# EAGLE design pentawallHDsmall (EAGLE 5.11)
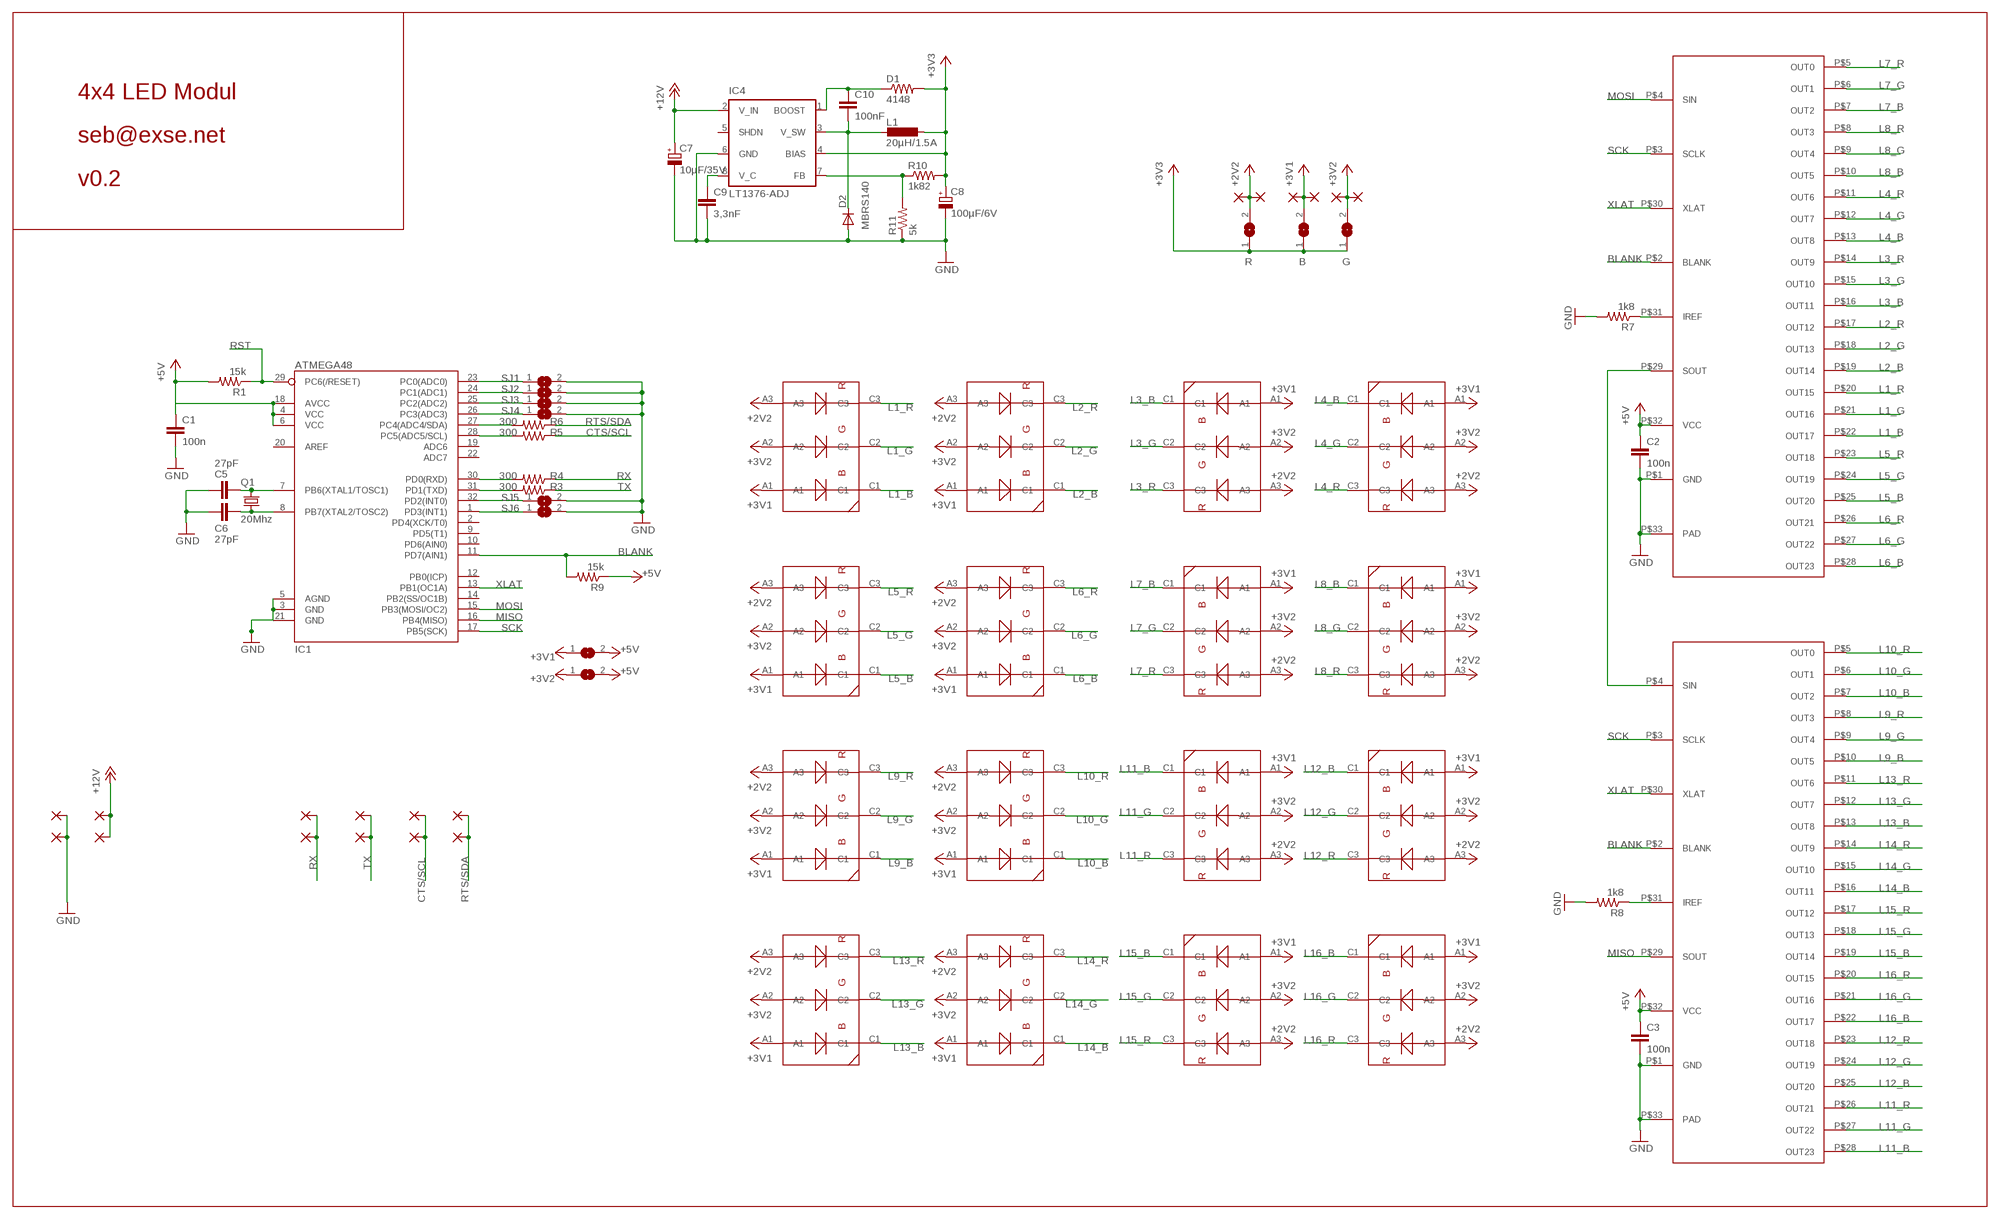
[diagram p0: schematic, sheet 1]

## Parts
B  SMD2  [SMD1,27-2,54]
B2  SMD2  [SMD1,27-2,54]
C1  100n  CAP0805  [0805]
C2  100n  CAP0805  [0805]
C3  100n  CAP0805  [0805]
C5  27pF  CAP0805  [0805]
C6  27pF  CAP0805  [0805]
C7  10µF/35V  CPOL-EUSMCD  [SMC_D]
C8  100µF/6V  CPOL-EUSMCD  [SMC_D]
C9  3,3nF  CAP0805  [0805]
C10  100nF  CAP0805  [0805]
D1  4148  RESISTOR1206  [1206]
D2  MBRS140  DIODE-SMB  [SMB]
G  SMD2  [SMD1,27-2,54]
G2  SMD2  [SMD1,27-2,54]
IC1  ATMEGA48  ATMEGA168  [TQFP32-08]
IC2  TLC5947  [HTSSOP32_DAP]
IC3  TLC5947  [HTSSOP32_DAP]
IC4  LT1376-ADJ  LT1376  [SO-08]
L1  20µH/1.5A  DO3316P  [DO3316P]
PAD1  SMD2  [SMD1,27-2,54]
PAD2  SMD2  [SMD1,27-2,54]
PAD3  SMD2  [SMD1,27-2,54]
PAD4  SMD2  [SMD1,27-2,54]
PAD5  SMD2  [SMD1,27-2,54]
PAD6  SMD2  [SMD1,27-2,54]
PAD7  SMD2  [SMD1,27-2,54]
PAD8  SMD2  [SMD1,27-2,54]
PAD9  SMD2  [SMD1,27-2,54]
PAD10  SMD2  [SMD1,27-2,54]
PAD17  SMD2  [SMD1,27-2,54]
PAD18  SMD2  [SMD1,27-2,54]
Q1  20Mhz  X22-OSCILLATOR  [X22]
R  SMD2  [SMD1,27-2,54]
R1  15k  RESISTOR  [0805]
R2  SMD2  [SMD1,27-2,54]
R3  300  RESISTOR  [0805]
R4  300  RESISTOR  [0805]
R5  300  RESISTOR  [0805]
R6  300  RESISTOR  [0805]
R7  1k8  RESISTOR  [0805]
R8  1k8  RESISTOR  [0805]
R9  15k  RESISTOR  [0805]
R10  1k82  RESISTOR  [0805]
R11  5k  RESISTOR  [0805]
SJ1  SJ  [SJ]
SJ2  SJ  [SJ]
SJ3  SJ  [SJ]
SJ4  SJ  [SJ]
SJ5  SJ  [SJ]
SJ6  SJ  [SJ]
SJ7  SJ  [SJ]
SJ8  SJ  [SJ]
SJ9  SJ  [SJ]
SJ10  SJ  [SJ]
SJ11  SJ  [SJ]
U$1  OSRAM_LRTB_GFTG  OSRAM_LRTB_GFTGSMALL  [PLCC-6_SMALL]
U$2  OSRAM_LRTB_GFTG  OSRAM_LRTB_GFTGSMALL  [PLCC-6_SMALL]
U$3  OSRAM_LRTB_GFTG  OSRAM_LRTB_GFTGSMALL  [PLCC-6_SMALL]
U$4  OSRAM_LRTB_GFTG  OSRAM_LRTB_GFTGSMALL  [PLCC-6_SMALL]
U$5  OSRAM_LRTB_GFTG  OSRAM_LRTB_GFTGSMALL  [PLCC-6_SMALL]
U$6  OSRAM_LRTB_GFTG  OSRAM_LRTB_GFTGSMALL  [PLCC-6_SMALL]
U$7  OSRAM_LRTB_GFTG  OSRAM_LRTB_GFTGSMALL  [PLCC-6_SMALL]
U$8  OSRAM_LRTB_GFTG  OSRAM_LRTB_GFTGSMALL  [PLCC-6_SMALL]
U$9  OSRAM_LRTB_GFTG  OSRAM_LRTB_GFTGSMALL  [PLCC-6_SMALL]
U$10  OSRAM_LRTB_GFTG  OSRAM_LRTB_GFTGSMALL  [PLCC-6_SMALL]
U$11  OSRAM_LRTB_GFTG  OSRAM_LRTB_GFTGSMALL  [PLCC-6_SMALL]
U$12  OSRAM_LRTB_GFTG  OSRAM_LRTB_GFTGSMALL  [PLCC-6_SMALL]
U$13  OSRAM_LRTB_GFTG  OSRAM_LRTB_GFTGSMALL  [PLCC-6_SMALL]
U$14  OSRAM_LRTB_GFTG  OSRAM_LRTB_GFTGSMALL  [PLCC-6_SMALL]
U$15  OSRAM_LRTB_GFTG  OSRAM_LRTB_GFTGSMALL  [PLCC-6_SMALL]
U$16  OSRAM_LRTB_GFTG  OSRAM_LRTB_GFTGSMALL  [PLCC-6_SMALL]

## Nets
+12V: C7.+ IC4.2(V_IN) PAD5.1(P) PAD6.1(P)
BLANK: IC1.11(PD7(AIN1)) IC2.P$2(BLANK) IC3.P$2(BLANK) R9.2
CTS/SCL: PAD7.1(P) PAD8.1(P) R5.1
DVCC: C1.1 C2.1 C3.1 IC1.4(VCC) IC1.6(VCC) IC1.18(AVCC) IC2.P$32(VCC) IC3.P$32(VCC) R1.2 R9.1 SJ7.2 SJ11.2 ; supply symbol labelled +5V
GND: C1.2 C2.2 C3.2 C5.1 C6.1 C7.- C8.- C9.2 D2.A IC1.3(GND) IC1.5(AGND) IC1.21(GND) IC2.P$1(GND) IC2.P$33(PAD) IC3.P$1(GND) IC3.P$33(PAD) IC4.6(GND) PAD1.1(P) PAD2.1(P) R7.2 R8.2 R11.1 SJ1.2 SJ2.2 SJ3.2 SJ4.2 SJ5.2 SJ6.2
L1_B: IC2.P$22(OUT17) U$8.C1
L1_G: IC2.P$21(OUT16) U$8.C2
L1_R: IC2.P$20(OUT15) U$8.C3
L2_B: IC2.P$19(OUT14) U$7.C1
L2_G: IC2.P$18(OUT13) U$7.C2
L2_R: IC2.P$17(OUT12) U$7.C3
L3_B: IC2.P$16(OUT11) U$1.C1
L3_G: IC2.P$15(OUT10) U$1.C2
L3_R: IC2.P$14(OUT9) U$1.C3
L4_B: IC2.P$13(OUT8) U$3.C1
L4_G: IC2.P$12(OUT7) U$3.C2
L4_R: IC2.P$11(OUT6) U$3.C3
L5_B: IC2.P$25(OUT20) U$2.C1
L5_G: IC2.P$24(OUT19) U$2.C2
L5_R: IC2.P$23(OUT18) U$2.C3
L6_B: IC2.P$28(OUT23) U$10.C1
L6_G: IC2.P$27(OUT22) U$10.C2
L6_R: IC2.P$26(OUT21) U$10.C3
L7_B: IC2.P$7(OUT2) U$6.C1
L7_G: IC2.P$6(OUT1) U$6.C2
L7_R: IC2.P$5(OUT0) U$6.C3
L8_B: IC2.P$10(OUT5) U$9.C1
L8_G: IC2.P$9(OUT4) U$9.C2
L8_R: IC2.P$8(OUT3) U$9.C3
L9_B: IC3.P$10(OUT5) U$14.C1
L9_G: IC3.P$9(OUT4) U$14.C2
L9_R: IC3.P$8(OUT3) U$14.C3
L10_B: IC3.P$7(OUT2) U$13.C1
L10_G: IC3.P$6(OUT1) U$13.C2
L10_R: IC3.P$5(OUT0) U$13.C3
L11_B: IC3.P$28(OUT23) U$12.C1
L11_G: IC3.P$27(OUT22) U$12.C2
L11_R: IC3.P$26(OUT21) U$12.C3
L12_B: IC3.P$25(OUT20) U$5.C1
L12_G: IC3.P$24(OUT19) U$5.C2
L12_R: IC3.P$23(OUT18) U$5.C3
L13_B: IC3.P$13(OUT8) U$11.C1
L13_G: IC3.P$12(OUT7) U$11.C2
L13_R: IC3.P$11(OUT6) U$11.C3
L14_B: IC3.P$16(OUT11) U$15.C1
L14_G: IC3.P$15(OUT10) U$15.C2
L14_R: IC3.P$14(OUT9) U$15.C3
L15_B: IC3.P$19(OUT14) U$16.C1
L15_G: IC3.P$18(OUT13) U$16.C2
L15_R: IC3.P$17(OUT12) U$16.C3
L16_B: IC3.P$22(OUT17) U$4.C1
L16_G: IC3.P$21(OUT16) U$4.C2
L16_R: IC3.P$20(OUT15) U$4.C3
MISO: IC1.16(PB4(MISO)) IC3.P$29(SOUT)
MOSI: IC1.15(PB3(MOSI/OC2)) IC2.P$4(SIN)
N$1: IC1.23(PC0(ADC0)) SJ1.1
N$2: IC1.30(PD0(RXD)) R4.2
N$3: IC1.28(PC5(ADC5/SCL)) R5.2
N$4: IC1.24(PC1(ADC1)) SJ2.1
N$5: IC1.25(PC2(ADC2)) SJ3.1
N$6: IC1.26(PC3(ADC3)) SJ4.1
N$7: IC1.1(PD3(INT1)) SJ6.1
N$8: IC1.32(PD2(INT0)) SJ5.1
N$9: IC2.P$29(SOUT) IC3.P$4(SIN)
N$10: IC4.7(FB) R10.1 R11.2
N$11: IC3.P$31(IREF) R8.1
N$12: IC2.P$31(IREF) R7.1
N$13: IC1.31(PD1(TXD)) R3.2
N$15: IC1.27(PC4(ADC4/SDA)) R6.2
N$30: C5.2 IC1.7(PB6(XTAL1/TOSC1)) Q1.3
N$32: C6.2 IC1.8(PB7(XTAL2/TOSC2)) Q1.1
N$56: C9.1 IC4.8(V_C)
N$57: C10.2 D2.C IC4.3(V_SW) L1.1
N$58: C10.1 D1.1 IC4.1(BOOST)
RST: IC1.29(PC6(/RESET)) R1.1
RTS/SDA: PAD9.1(P) PAD10.1(P) R6.1
RX: PAD17.1(P) PAD18.1(P) R4.1
SCK: IC1.17(PB5(SCK)) IC2.P$3(SCLK) IC3.P$3(SCLK)
TX: PAD3.1(P) PAD4.1(P) R3.1
VCC: C8.+ D1.2 IC4.4(BIAS) L1.2 R10.2 SJ8.1 SJ9.1 SJ10.1 ; supply symbol labelled +3V3
VCC_B: B2.1(P) B.1(P) SJ7.1 SJ9.2 U$1.A1 U$2.A1 U$3.A1 U$4.A1 U$5.A1 U$6.A1 U$7.A1 U$8.A1 U$9.A1 U$10.A1 U$11.A1 U$12.A1 U$13.A1 U$14.A1 U$15.A1 U$16.A1 ; supply symbol labelled +3V1
VCC_G: G2.1(P) G.1(P) SJ10.2 SJ11.1 U$1.A2 U$2.A2 U$3.A2 U$4.A2 U$5.A2 U$6.A2 U$7.A2 U$8.A2 U$9.A2 U$10.A2 U$11.A2 U$12.A2 U$13.A2 U$14.A2 U$15.A2 U$16.A2 ; supply symbol labelled +3V2
VCC_R: R2.1(P) R.1(P) SJ8.2 U$1.A3 U$2.A3 U$3.A3 U$4.A3 U$5.A3 U$6.A3 U$7.A3 U$8.A3 U$9.A3 U$10.A3 U$11.A3 U$12.A3 U$13.A3 U$14.A3 U$15.A3 U$16.A3 ; supply symbol labelled +2V2
XLAT: IC1.13(PB1(OC1A)) IC2.P$30(XLAT) IC3.P$30(XLAT)
Unconnected: IC1.2(PD4(XCK/T0)) IC1.9(PD5(T1)) IC1.10(PD6(AIN0)) IC1.12(PB0(ICP)) IC1.14(PB2(SS/OC1B)) IC1.19(ADC6) IC1.20(AREF) IC1.22(ADC7) IC4.5(SHDN)

## Notes on the sheet
- 4x4 LED Modul
- seb@exse.net
- v0.2

## Library data of the parts
B B2 G G2 PAD1-PAD10 PAD17 PAD18 R R2 = wirepad:SMD2: SMD PAD
C1-C3 C5 C6 C9 C10 = SparkFun:CAP: Capacitor Standard 0603 ceramic capacitor, and 0.1" leaded capacitor.
C7 C8 = resistor:CPOL-EU: POLARIZED CAPACITOR, European symbol
D1 R1 R3-R11 = SparkFun:RESISTOR: Resistor Basic schematic elements and footprints for 0603, 1206, and PTH 1/10th watt (small) resistors.
D2 = diode:DIODE-: DIODE
IC1 = SparkFun:ATMEGA168
IC2 IC3 = tlc5947:TLC5947
IC4 = v-reg:LT1376
L1 = inductor-coilcraft:DO3316P: COILCRAFT; OC_FARNELL: unknown; OC_NEWARK: unknown
Q1 = seb:X22-OSCILLATOR
SJ1-SJ11 = jumper:SJ: SMD solder JUMPER
U$1-U$16 = seb:OSRAM_LRTB_GFTG

## Board
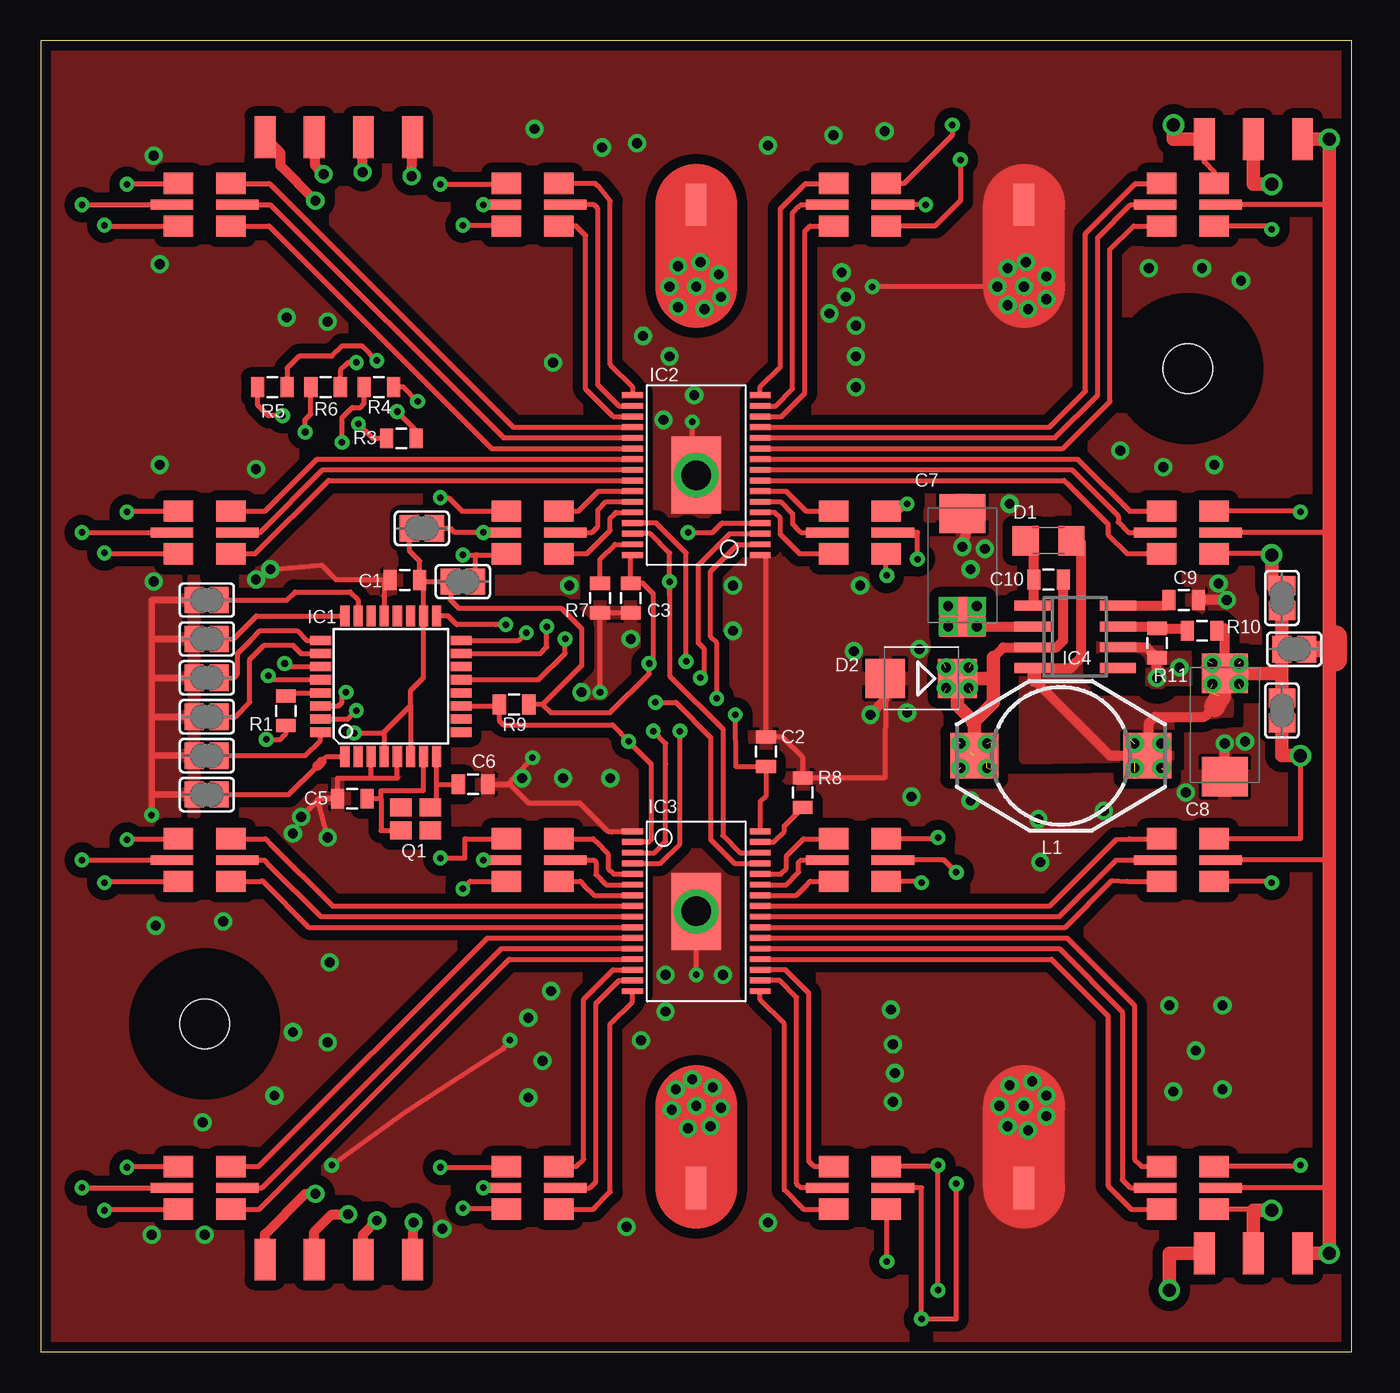
[diagram p1: board, top side]
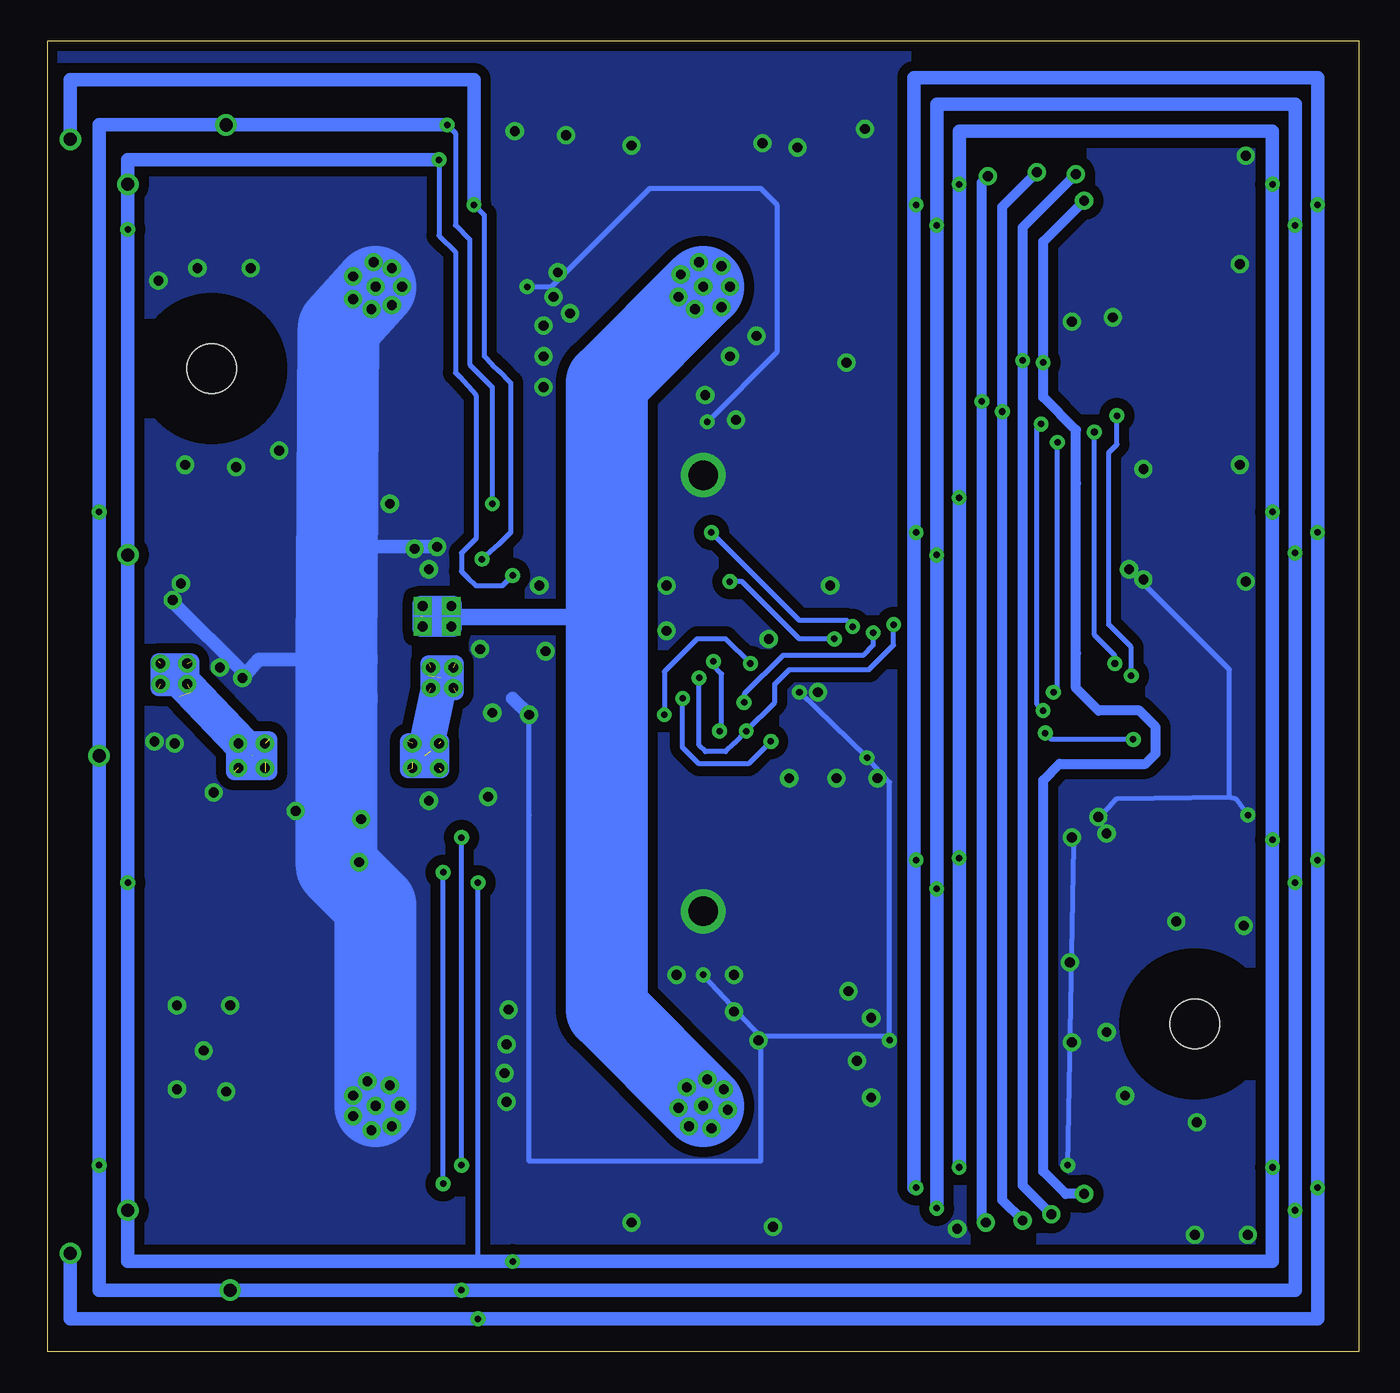
[diagram p2: board, bottom side, seen from below]

Size 80 x 80 mm. Coordinates in mm from the lower left corner, seen from the top.
Outline: 80,0 80,80 0,80 0,0 80,0
Copper layers (1*16): Top 0.035mm / dielectric 1.5mm / Bottom 0.035mm
Design rules "PCBCart-Standard *": minimum track width 12mil, minimum drill 0.4mm, track to track 13mil, track to pad 12mil, pad to pad 9mil, via to via 13mil, smd to smd 8mil, copper to edge 20mil, drill to drill 8mil, minimum pad ring 8mil, minimum via ring 10mil, stop-mask expansion 2mil, vias tented up to drill 2mm, thermal gap 8mil
Holes 3 mm at 10,20 70,60
tKeepout: 1 lines
tRestrict: area 69,59 to 71,61; area 9,19 to 11,21
bRestrict: area 69,59 to 71,61; area 9,19 to 11,21

### Footprints (pad centres in the part's own frame; a part is rotated, then mirrored left to right if it is on the bottom)
SMD1,27-2,54 = smd 1.27 x 2.54: 1 0,0
0805 = smd 0.8 x 1.2: 1 -0.9,0; 2 0.9,0
SMC_D = smd 2.4 x 2.8: + -3.15,0; - 3.15,0
1206 = smd 1.6 x 1.8: 1 -1.4,0; 2 1.4,0
SMB = smd 2.4 x 2.4: A 2.2,0; C -2.2,0
TQFP32-08 = smd 1.27 x 0.559: 1 -4.293,2.8; 2 -4.293,2; 3 -4.293,1.2; 4 -4.293,0.4; 5 -4.293,-0.4; 6 -4.293,-1.2; 7 -4.293,-2; 8 -4.293,-2.8; 17 4.293,-2.8; 18 4.293,-2; 19 4.293,-1.2; 20 4.293,-0.4; 21 4.293,0.4; 22 4.293,1.2; 23 4.293,2; 24 4.293,2.8 | smd 0.559 x 1.27: 9 -2.8,-4.293; 10 -2,-4.293; 11 -1.2,-4.293; 12 -0.4,-4.293; 13 0.4,-4.293; 14 1.2,-4.293; 15 2,-4.293; 16 2.8,-4.293; 25 2.8,4.293; 26 2,4.293; 27 1.2,4.293; 28 0.4,4.293; 29 -0.4,4.293; 30 -1.2,4.293; 31 -2,4.293; 32 -2.8,4.293
HTSSOP32_DAP = smd 0.356 x 1.27: P$1 -4.875,-3.9; P$2 -4.225,-3.9; P$3 -3.575,-3.9; P$4 -2.925,-3.9; P$5 -2.275,-3.9; P$6 -1.625,-3.9; P$7 -0.975,-3.9; P$8 -0.325,-3.9; P$9 0.325,-3.9; P$10 0.975,-3.9; P$11 1.625,-3.9; P$12 2.275,-3.9; P$13 2.925,-3.9; P$14 3.575,-3.9; P$15 4.225,-3.9; P$16 4.875,-3.9; P$17 4.875,3.9; P$18 4.225,3.9; P$19 3.575,3.9; P$20 2.925,3.9; P$21 2.275,3.9; P$22 1.625,3.9; P$23 0.975,3.9; P$24 0.325,3.9; P$25 -0.325,3.9; P$26 -0.975,3.9; P$27 -1.625,3.9; P$28 -2.275,3.9; P$29 -2.925,3.9; P$30 -3.575,3.9; P$31 -4.225,3.9; P$32 -4.875,3.9 | smd 4.698 x 3: P$33 0,0
SO-08 = smd 0.6 x 2.2: 1 -1.905,-2.6; 2 -0.635,-2.6; 3 0.635,-2.6; 4 1.905,-2.6; 5 1.905,2.6; 6 0.635,2.6; 7 -0.635,2.6; 8 -1.905,2.6
DO3316P = smd 2.92 x 2.79: 1 -5.28,0; 2 5.28,0
X22 = smd 1.3 x 1.1: 1 0.9,0.7; 2 -0.9,0.7; 3 -0.9,-0.7; 4 0.9,-0.7
SJ = smd 1.168 x 1.6: 1 -0.762,0; 2 0.762,0
PLCC-6_SMALL = smd 1.3 x 1.8: A1 1.3,-1.6; A3 -1.3,-1.6; C1 1.3,1.6; C3 -1.3,1.6 | smd 0.6 x 2.6: A2 0,-2; C2 0,2

### Placement (x,y rotation side)
B  71,6 180 top
B2  71,74 180 top
C1  22.21,47.09 180 top
C2  44.25,36.62 90 top
C3  36,46 270 top
C5  19,33.75 0 top
C6  26.38,34.62 180 top
C7  56.25,48 90 top
C8  72.25,38.25 270 top
C9  69.75,45.88 0 top
C10  61.5,47.12 0 top
D1  61.5,49.5 0 top
D2  53.73,41.09 180 top
G  77,6 180 top
G2  77,74 180 top
IC1  21.36,40.61 90 top
IC2  40,53.5 90 top
IC3  40,26.88 270 top
IC4  63.12,43.62 270 top
L1  62.25,36.38 0 top
PAD1  60,70 0 top
PAD2  60,10 0 top
PAD3  19.68,74.12 180 top
PAD4  19.68,5.62 180 top
PAD5  40,10 0 top
PAD6  40,70 180 top
PAD7  16.68,74.12 0 top
PAD8  16.68,5.62 0 top
PAD9  13.68,74.12 0 top
PAD10  13.68,5.62 0 top
PAD17  22.68,5.62 180 top
PAD18  22.68,74.12 180 top
Q1  22.88,32.5 0 top
R  74,6 180 top
R1  14.96,39.11 270 top
R2  74,74 180 top
R3  22,55.75 180 top
R4  20.62,58.88 180 top
R5  14.12,58.88 180 top
R6  17.38,58.88 180 top
R7  34.12,46 270 top
R8  46.5,34.12 90 top
R9  28.88,39.5 180 top
R10  70.88,44 0 top
R11  68.12,43.25 90 top
SJ1  10.12,45.88 180 top
SJ2  10.12,43.5 180 top
SJ3  10.12,41.12 180 top
SJ4  10.12,38.75 180 top
SJ5  10.12,36.38 180 top
SJ6  10.12,34 180 top
SJ7  25.75,47 180 top
SJ8  75.75,46 90 top
SJ9  75.75,39.12 270 top
SJ10  76.5,42.88 0 top
SJ11  23.25,50.25 180 top
U$1  50,70 90 top
U$2  10,50 270 top
U$3  70,70 90 top
U$4  70,10 90 top
U$5  70,30 90 top
U$6  50,50 90 top
U$7  30,70 270 top
U$8  10,70 270 top
U$9  70,50 90 top
U$10  30,50 270 top
U$11  10,10 270 top
U$12  50,30 90 top
U$13  30,30 270 top
U$14  10,30 270 top
U$15  30,10 270 top
U$16  50,10 90 top

### Tracks (layer width: path | path; a pad name or v marks a point on that pad's centre or on a via)
+12V  (via drill 0.6)  (2 unrouted)
  Top 0.305: v40,15 39.5,14.5 v39.5,13.62 39.62,13.75 v40.88,13.75 41.5,14.38 v41.5,14.88 41,15.38 v41,16.12 40.5,16.62 v39.75,16.62 39.12,16 v38.75,16 38.5,15.75 v38.5,14.75 | v40,65 40.25,65.25 v40.25,66.5 40.12,66.25 v38.88,66.25 38.5,65.88 v38.38,65 39.12,64.38 v38.88,63.75 39.5,63.5 v40.5,63.62 41.12,64.38 v41.5,64.38 v41.38,65.75
  Top 0.61: IC4.2 56.97,44.26 C7.+
  Top 1.016: v55.38,45.5 55.38,44.85 C7.+ | v55.38,44.25 v55.38,45.5 | v55.38,45.5 v57.12,45.5 | C7.+ 57.12,44.85 v57.12,44.25 56.25,44.25 C7.+
  Top 5: v40,65 PAD6.1 | PAD5.1 v40,15
  Bottom 1.016: 45.88,42.5 46.5,43.12 46.5,43.5 46.62,43.62 46.62,44.85 C7.+ | 57.25,44.88 57.25,44.12 55.25,44.12 55.25,44.88 | 57.25,44.88 57.25,45.62 55.25,45.62 55.25,44.88 | 55.25,44.88 57.25,44.88 | 55.25,44.88 57.25,44.88
  Bottom 5: v40,65 45.88,59.12 45.88,42.5 45.88,20.88 v40,15
BLANK  (via drill 0.4)
  Top 0.305: IC2.P$2 42.52,49.27 41.25,48 40.88,47.62 40.88,43.62 41.25,43.25 v41.25,39.88 | IC1.11 27.98,39.41 R9.2 27.98,38.52 28.25,38.25 34.88,38.25 v35.88,37.25 37.25,35.88 37.25,34.75 37.25,31.25 37.1,31.1 IC3.P$2
  Bottom 0.305: v41.25,39.88 41.25,36.88 40.25,35.88 37.25,35.88 v35.88,37.25
CTS/SCL  (via drill 0.4, 0.6)
  Top 0.305: R5.1 15.03,60.02 15.75,60.75 17.75,60.75 18.38,61.38 19.38,61.38 19.62,61.38 v20.5,60.5
  Top 0.61: v17.25,71.88 16.75,72.38 PAD7.1 | v18.75,8.38 17.75,8.38 16.68,7.3 PAD8.1
  Bottom 0.305: 20.5,60.38 v20.5,60.5
  Bottom 0.61: v18.75,8.38 20.5,10.12 20.5,37.5 20.5,60.38 v20.5,60.5 20.5,68.62 v17.25,71.88
DVCC  (via drill 0.4)
  Top 0.305: IC2.P$32 36,48.6 C3.1 36.73,46.9 37.38,46.25 37.38,42.25 v37.12,42 37.12,41.38 34.75,39 31.12,39 30.62,39.5 | v42.38,38.88 42.4,35.73 C2.1 44.25,33.9 43.9,33.55 IC3.P$32 | 20.95,37.83 IC1.4 | 20.95,37.83 22.56,39.44 | IC1.6 22.55,39.3 22.56,39.44 | 23.36,46.62 23.36,46.76 | 23.36,46.62 IC1.18 23.36,41.15 22.56,40.35 22.56,39.44 | 23.11,47.12 23.11,47.4 23.12,48.25 22.5,48.88 22.5,49.25 22.5,50.25 SJ11.2 | 23.36,46.62 23.11,47.12 | 30.62,39.5 R9.1 | 30.62,39.5 33,41.88 33,44.12 31.75,45.38 25.5,45.38 24.99,45.89 SJ7.2 23.11,47 C1.1 23.11,47.12 | v19.12,37.75 20.88,37.75 20.95,37.83 | v13.75,37.38 14.62,37.38 14.88,37.62 14.96,37.71 R1.2
  Bottom 0.305: v42.38,38.88 42.38,41.5 40.38,43.5 39.12,43.5 38.62,43.5 v37.12,42 | v13.75,37.38 18.75,37.38 v19.12,37.75
GND  (via drill 0.4, 0.6, 1.8)
  Top 0.305: IC2.P$1 44.25,48.6 C2.2 45.23,37.52 46.5,36.25 R8.2 51.5,35.02 D2.A | IC3.P$1 34.62,31.75 32.88,33.5 29.75,33.5 28.62,34.62 C6.1 28.5,34.65 v30,36.25 | C5.1 17,33.75 v15.88,32.62 | IC1.5 21.75,35 20.16,35 | 20.16,35 IC1.3 | 20.16,35 18.1,35 C5.1 | 20.95,47.09 C1.2 21.38,47.09 | 20.95,47.09 IC1.21 | 20.95,47.09 20.95,47.12 18,47.12 17.12,48 v14,47.75 | v28.62,19 28.25,18.5 22.25,14.62 v17.75,11.38 | v40,23 IC3.P$33 | IC2.P$33 39.75,53.75 v39.75,56.75 | v60,65 v50.75,65 | C3.2 R7.2 34.12,40.62 v34.12,40.25 | C5.1 16.88,33.73 v17.5,31.38
  Top 0.406: SJ1.2 6.75,45.88 6.75,43.5 | v6.75,32.75 6.75,34 | 6.75,34 6.75,36.38 | 6.75,38.75 6.75,41.12 | 6.75,43.5 SJ2.2 | 6.75,41.12 SJ3.2 | 6.75,41.12 6.75,43.5 | 6.75,38.75 SJ4.2 | 6.75,36.38 SJ5.2 | 6.75,36.38 6.75,38.75 | 6.75,34 SJ6.2
  Top 0.61: IC4.6 67.48,42.99 R11.1 v68.12,41.12 | v72.38,45.88 C9.2 | C8.- v72.25,37.12 | C7.- 56.88,51.27 v56.25,49.12 | D2.A 51.5,39.82 v50.62,38.88
  Top 5: v60,65 PAD1.1 | PAD2.1 v60,15
  Bottom 0.305: v6.75,32.75 7.5,33.75 7.88,33.87 | 7.88,33.87 14.75,33.75 15.12,33.38 v15.88,32.62 | v28.62,19 28.62,19.25 | 28.62,19.25 28.62,34.75 v30,36.25 v34.12,40.25 | 28.62,19.25 36.5,19.25 | v39.75,56.75 35.5,61 35.5,70 36.5,71 43.25,71 49.25,65 v50.75,65 | 36.5,19.25 36.5,11.62 50.62,11.62 50.62,32.75 v50.62,38.88 | 36.5,19.25 v40,23 | v14,47.75 7.88,41.63 7.88,33.87 | v17.5,31.38 17.38,30.88 v17.75,11.38
  Bottom 0.61: 72.25,45.62 v72.38,45.88
  Bottom 0.813: v68.12,41.12 68.25,41.25 | 72.25,45.62 68.12,41.5 v68.12,41.12 | v68.12,41.12 67.12,42.25 62.38,42.25 | v56.25,49.12 60.49,49.13 62.25,62.51 | v50.62,38.88 51.62,39.87
  Bottom 5: v60,15 60,27.25 62.38,29.62 62.38,39.87 62.38,42.25 62.25,62.51 v60,65
  other vias: 69.5,41.75 73.5,37.25 57.62,49 49.62,42.75 69.88,34.12 71.88,46.88 59.12,51.75 56.75,47.75 53.62,42.88 52.88,39 70.5,18.38 73.25,65.38 51.5,74.5 44.38,73.62 60.12,66.5 59,63.88 60.25,63.62 58.38,65 61.38,65.62 61.38,64.25 59,66.12 61.38,15.62 61.38,14.38 58.5,15 59,13.75 59.12,16.25 60.5,16.5 52,15.25 52.12,17 52,18.75 51.88,20.88 41.62,23 38.12,23 36.62,19 38.12,20.75 49.75,58.88 49.75,60.75 49.75,62.62 48.88,65.88 48.12,63.38 49.12,64.38 38,56.88 39.88,58.38 38.38,60.75 36.75,62 7,26 6.88,47 13.12,47.12 15.38,31.62 34.75,35 31.88,35 29.38,35 31.25,60.38 13.12,53.88 15,63.12 7.25,66.38 7.25,54.12 9.88,14 14.25,15.62 15.38,19.5 11.12,26.25 69.12,15.88 72.12,16 72.12,21.12 68.88,21.12 71.62,54.12 68.5,54 65.88,55 67.62,66.12 70.88,66.12 30.12,74.62 34.25,73.5 36.38,73.75 48.38,74.25 64.88,33 61,29.88 60.88,32.5 56.75,33.62 53.12,33.88 40,26.88 40,53.5 60.25,13.5 33,40.25 36,43.5 42.25,44 42.25,46.75 31.12,22 29.75,20.38 30.62,17.75 29.75,15.5 24.5,7.5 35.75,7.62 44.38,7.88 17.62,23.75 17.5,18.88 10,7.12 6.75,7.12 6.88,73 17.5,62.88 32.25,46.75 50,46.75
  pour Bottom (isolate 0.61): 0,0 80,0 80,80 0,80
  pour Top (isolate 0.61, rank 2): 80,0 0,0 0,80 80,80
L1_B
  Top 0.305: IC2.P$22 27.5,55.12 13.93,68.7 U$8.C1
L1_G
  Top 0.305: IC2.P$21 28.23,55.77 14,70 U$8.C2
L1_R
  Top 0.305: IC2.P$20 28.82,56.42 13.95,71.3 U$8.C3
L2_B
  Top 0.305: IC2.P$19 34.92,57.08 33.25,58.75 33.25,68.12 33.12,68.25 32.67,68.7 U$7.C1
L2_G
  Top 0.305: IC2.P$18 35.27,57.73 34,59 34,69.75 33.75,70 U$7.C2
L2_R
  Top 0.305: U$7.C3 33.83,71.3 34.12,71 34.75,70.25 34.75,60.25 36.1,58.9 IC2.P$17
L3_B
  Top 0.305: U$1.C1 46.67,71.3 46.5,71.12 45.12,69.75 45.12,60.12 43.9,58.9 IC2.P$16
L3_G
  Top 0.305: IC2.P$15 44.85,57.73 45.88,58.75 45.88,69.5 46.25,69.88 46.38,70 U$1.C2
L3_R
  Top 0.305: IC2.P$14 45.2,57.08 46.62,58.5 46.62,68.38 46.75,68.5 46.95,68.7 U$1.C3
L4_B
  Top 0.305: IC2.P$13 61.55,56.42 63.75,58.62 63.75,68.25 66.8,71.3 U$3.C1
L4_G
  Top 0.305: IC2.P$12 61.9,55.77 64.5,58.38 64.5,68 66.5,70 U$3.C2
L4_R
  Top 0.305: IC2.P$11 62.38,55.12 65.25,58 65.25,67.3 66.62,68.62 66.7,68.7 U$3.C3
L5_B
  Top 0.305: IC2.P$25 17.55,53.17 13.07,48.7 U$2.C1
L5_G
  Top 0.305: IC2.P$24 17.2,53.83 13.38,50 U$2.C2
L5_R
  Top 0.305: IC2.P$23 16.85,54.48 13.68,51.3 U$2.C3
L6_B
  Top 0.305: U$10.C1 33.33,48.7 34.5,49.88 34.75,50.12 34.75,50.88 35,51.12 35.1,51.23 IC2.P$28
L6_G
  Top 0.305: U$10.C2 33.62,50 34,50.38 34,51.38 34.5,51.88 IC2.P$27
L6_R
  Top 0.305: IC2.P$26 34.02,52.52 33,51.5 32.8,51.3 U$10.C3
L7_B
  Top 0.305: IC2.P$7 45.48,52.52 46.5,51.5 46.7,51.3 U$6.C1
L7_G
  Top 0.305: IC2.P$6 45.12,51.88 45.88,51.12 45.88,50.5 46.25,50.12 46.38,50 U$6.C2
L7_R
  Top 0.305: IC2.P$5 44.77,51.23 45.12,50.88 45.12,49.88 46.3,48.7 U$6.C3
L8_B
  Top 0.305: IC2.P$10 63.27,54.48 63.62,54.12 66.45,51.3 U$9.C1
L8_G
  Top 0.305: U$9.C2 66.38,50 65.75,50.62 65.75,51 63.12,53.62 62.92,53.83 IC2.P$9
L8_R
  Top 0.305: IC2.P$8 62.45,53.17 62.62,53 65.12,50.5 65.12,49.88 66.3,48.7 U$9.C3
L9_B
  Top 0.305: IC3.P$10 16.35,25.9 13.5,28.75 13.45,28.7 U$14.C1
L9_G
  Top 0.305: IC3.P$9 17.07,26.55 13.88,29.75 13.62,30 U$14.C2
L9_R
  Top 0.305: IC3.P$8 17.8,27.2 14,31 13.7,31.3 U$14.C3
L10_B
  Top 0.305: IC3.P$7 33.77,27.85 33.12,28.5 32.92,28.7 U$13.C1
L10_G
  Top 0.305: IC3.P$6 34.5,28.5 33.88,29.12 33.88,29.88 33.75,30 U$13.C2
L10_R
  Top 0.305: IC3.P$5 34.98,29.15 34.62,29.5 34.62,30.38 33.88,31.12 33.7,31.3 U$13.C3
L11_B
  Top 0.305: IC3.P$28 45.15,29.15 45.5,29.5 45.5,30.25 46.5,31.25 46.55,31.3 U$12.C1
L11_G
  Top 0.305: IC3.P$27 45.5,28.5 46.25,29.25 46.25,29.88 46.38,30 U$12.C2
L11_R
  Top 0.305: IC3.P$26 46.1,27.85 46.75,28.5 46.95,28.7 U$12.C3
L12_B
  Top 0.305: IC3.P$25 61.58,27.2 65.62,31.25 66.42,31.3 U$5.C1
L12_G
  Top 0.305: IC3.P$24 62.17,26.55 65.38,29.75 65.62,30 U$5.C2
L12_R
  Top 0.305: IC3.P$23 62.52,25.9 65.38,28.75 66.3,28.7 U$5.C3
L13_B
  Top 0.305: IC3.P$13 28.57,23.95 13.32,8.7 U$11.C1
L13_G
  Top 0.305: IC3.P$12 28.1,24.6 13.5,10 U$11.C2
L13_R
  Top 0.305: 36.12,25.25 IC3.P$11 27.25,25.25 13.3,11.3 U$11.C3
L14_B
  Top 0.305: 33.7,8.7 33.88,8.88 | U$15.C1 33.7,8.7 | IC3.P$16 36.1,21.35 34.75,20 34.75,9.75 33.7,8.7
L14_G
  Top 0.305: IC3.P$15 35.27,22.65 33.88,21.25 33.88,10.38 33.5,10 U$15.C2
L14_R
  Top 0.305: IC3.P$14 34.92,23.3 33.12,21.5 33.12,11.75 32.67,11.3 U$15.C3
L15_B
  Top 0.305: IC3.P$19 45.45,23.3 46.88,21.88 46.88,11.62 47.12,11.38 47.2,11.3 U$16.C1
L15_G
  Top 0.305: IC3.P$18 45.1,22.65 46.12,21.62 46.12,10.25 46.25,10.12 46.38,10 U$16.C2
L15_R
  Top 0.305: 46.55,8.7 46.38,8.88 | 46.55,8.7 U$16.C3 | IC3.P$17 43.9,21.48 45.38,20 45.38,9.88 46.55,8.7
L16_B
  Top 0.305: IC3.P$22 62.62,25.25 66.75,21.12 66.75,11.75 67.12,11.38 67.2,11.3 U$4.C1
L16_G
  Top 0.305: IC3.P$21 62.15,24.6 66,20.75 66,10.5 66.38,10.12 66.5,10 U$4.C2
L16_R
  Top 0.305: IC3.P$20 61.67,23.95 65.12,20.5 65.12,10.12 66.38,8.88 66.55,8.7 U$4.C3
MISO  (via drill 0.4)
  Top 0.305: v37.5,39.62 38.75,39.62 40.88,37.5 40.88,31.25 42.33,29.8 IC3.P$29 | IC1.16 29.16,43.41 v29.62,43.88
  Bottom 0.305: v29.62,43.88 29.62,43.12 30.25,42.5 35.12,42.5 37.5,40.12 v37.5,39.62
MOSI  (via drill 0.4)
  Top 0.305: IC1.15 30.48,42.61 30.88,43 v30.88,44.25 | IC2.P$4 41.58,50.58 41,50 v39.5,50
  Bottom 0.305: v39.5,50 36.25,46.75 34.12,44.62 31.25,44.62 v30.88,44.25
N$1
  Top 0.305: IC1.23 19.36,45.9 18.88,46.38 15.5,46.38 15,45.88 SJ1.1
N$2  (via drill 0.4)
  Top 0.305: IC1.30 17.79,39.41 18.16,39.41 18.38,39.62 18.38,40 v18.62,40.25 | v18.38,55.5 18.38,57 19,57.62 19.5,57.62 19.73,57.85 R4.2
  Bottom 0.305: v18.62,40.25 18.38,40.5 v18.38,55.5
N$3  (via drill 0.4)
  Top 0.305: IC1.28 14.12,41.01 v13.88,41.25 | v14.75,57.12 13.88,57.12 13.38,57.62 13.22,57.77 R5.2
  Bottom 0.305: v13.88,41.25 13.88,43 15.25,44.38 15.25,54.88 14.75,55.38 v14.75,57.12
N$4
  Top 0.305: IC1.24 13.15,44.9 11.75,43.5 SJ2.1
N$5
  Top 0.305: SJ3.1 11.75,41.12 12,41.38 12,42.62 12.79,43.41 13.38,44 15.62,44 16.21,43.41 IC1.25
N$6
  Top 0.305: SJ4.1 11.88,38.75 12.75,39.62 12.75,42.25 13.11,42.61 13.62,43.12 15.38,43.12 15.89,42.61 IC1.26
N$7
  Top 0.305: IC1.1 17.44,36.32 17.12,36 | 16.88,35.75 15.12,34 SJ6.1
  Top 0.61: 16.88,35.75 17.12,36
N$8
  Top 0.305: IC1.32 17.06,37.31 16.12,36.38 SJ5.1
N$9  (via drill 0.4)
  Top 0.305: IC2.P$29 37.55,50.58 39.38,48.75 v39.38,42.12 | v39,37.88 39,31 37.8,29.8 IC3.P$4
  Bottom 0.305: v39,37.88 38.88,38 38.88,41.38 39.38,41.88 v39.38,42.12
N$10
  Top 0.61: IC4.7 68.11,44.26 R11.2 69.83,44.15 R10.1
N$11
  Top 0.305: R8.1 45.38,32.1 45.38,31.75 44.73,31.1 IC3.P$31
N$12
  Top 0.305: IC2.P$31 35.02,49.27 34.12,48.38 R7.1
N$13  (via drill 0.4)
  Top 0.305: v19.38,56.62 20.25,55.75 R3.2 | IC1.31 18.73,38.61 v19.25,39.12
  Bottom 0.305: v19.25,39.12 19.62,39.5 19.62,56.38 v19.38,56.62
N$14
  Top 1.422: 79,42.25 79,43.62
N$15  (via drill 0.4)
  Top 0.305: IC1.27 15.06,41.81 v14.88,42 | v16.12,56.12 16.12,56.88 16.38,57.12 16.48,57.23 R6.2
  Bottom 0.305: v14.88,42 14.88,42.5 16.12,43.75 v16.12,56.12
N$30
  Top 0.305: IC1.7 23.36,34.25 20.75,34.25 20.75,33.75 | 20.75,33.75 20.75,31.8 Q1.3 | C5.2 20.75,33.75
N$32
  Top 0.305: 24.16,34.62 24.16,33.45 Q1.1 | 24.16,34.62 IC1.8 | 24.16,34.62 C6.2
N$56
  Top 0.61: C9.1 68.63,45.53 IC4.8
N$57  (via drill 0.6)  (12 unrouted)
  Top 0.61: 58.12,42.38 58.74,42.99 IC4.3 61.99,42.99 62.12,43.12 62.4,43.4 C10.2 | 57.71,41.09 58.12,41.5
  Top 0.813: L1.1 56.97,38.41 56.62,38.75 55.94,39.44 D2.C 57.71,41.09 | 58.12,42.38 58.12,41.5 58.12,39.62 56.88,38.38
  Bottom 1.016: 55.12,41.25 55.12,40.25 56.75,40.25 56.75,41.25 | 55.12,41.25 55.12,42 56.75,42 56.75,41.25 | 55.12,41.25 56.75,41.25 | 56.25,36 57.75,36 57.75,36.62 56.62,36.62 | 56,35.5 58,35.5 58,37.25 56,37.25 56,35.5
  Bottom 2.184: 57,36.38 56,41.12
  other vias: 56.12,37.12 55.25,41.75 56.62,41.75 56.62,40.5 55.25,40.5 56.12,35.62 57.75,35.62 57.75,37.12
N$58
  Top 0.61: IC4.1 60.6,45.6 C10.1 60.6,49.12 D1.1
RST
  Top 0.305: R1.1 14.96,40.09 15.34,40.21 IC1.29
RTS/SDA  (via drill 0.4, 0.6)
  Top 0.305: R6.1 18.27,59.9 18.62,60.25 18.75,60.38 v19.25,60.38
  Top 0.61: PAD10.1 13.68,7.17 16.12,9.62 v16.75,9.62 | v16.75,70.25 14.62,72.38 14.62,73.17 PAD9.1
  Bottom 0.305: v19.25,60.38 19.25,61.62
  Bottom 0.61: v16.75,9.62 17.88,9.62 19.25,11 19.25,34.88 18.25,35.88 13,35.88 12.38,36.5 12.38,37.75 12.38,38.12 13.38,39.12 15.88,39.12 17.25,40.5 17.25,42.62 17.25,53 17.25,56.25 19.25,58.25 v19.25,60.38 19.25,61.62 19.25,67.75 v16.75,70.25
RX  (via drill 0.4, 0.6)
  Top 0.305: v23,58 22.12,58.88 R4.1
  Top 0.61: PAD17.1 v22.75,7.88 | v22.62,71.75 PAD18.1
  Bottom 0.61: v22.75,7.88 23,8.12 v23,58 23,71.38 v22.62,71.75
SCK  (via drill 0.4)
  Top 0.305: IC3.P$3 37.45,30.45 38.12,31.12 38.12,35.88 38.12,37.12 v37.38,37.88 | IC2.P$3 42.05,49.92 40.25,48.12 40.12,48 40.12,43.25 40.5,42.88 40.5,41.38 v40.25,41.12 | IC1.17 24.85,44.9 25.38,44.38 27.75,44.38 v28.38,44.38
  Bottom 0.305: v37.38,37.88 38.12,37.12 38.62,36.62 39.88,36.62 40.25,37 v40.25,41.12 | v28.38,44.38 28.38,43.12 29.88,41.62 34.75,41.62 35.62,40.75 35.62,39.62 v37.38,37.88 | v37.38,37.88 37.5,37.75 v37.38,37.88
TX  (via drill 0.4, 0.6)
  Top 0.305: R3.1 22.9,56.23 v21.75,57.38
  Top 0.61: v19.62,72 PAD3.1 | v20.5,8 19.68,7.17 PAD4.1
  Bottom 0.61: v20.5,8 21.75,9.25 v21.75,57.38 21.75,69.88 v19.62,72
VCC  (via drill 0.6)  (10 unrouted)
  Top 0.61: 60.62,41 65.25,36.38 L1.2 67.5,36.41 67.62,36.53 67.62,38.38 68,38.75 71,38.75 71.62,39.38 | 60.62,41.62 IC4.4 62.84,41.72 63,41.88 63.5,42.38 63.5,49.38 63.4,49.48 D1.2 | R10.2 72.25,44.15 C8.+
  Top 0.813: 60.62,41.62 60.62,41 | 75.74,41.38 SJ9.1 | 75.74,41.38 SJ10.1 SJ8.1 | C8.+ 75.71,41.4 75.74,41.38
  Top 1.27: 71.62,39.38 72,40 C8.+
  Bottom 1.016: 66.5,35.38 66.5,37.38 68.62,37.38 68.62,35.38 66.75,35.38 | 71.25,40.25 71.25,42.12 73.25,42.12 73.25,40.5 71.38,40.5 | 66.75,36 68.38,36 68.38,36.62 67,36.62
  Bottom 2.184: 67.5,36.38 72.12,41.25
  other vias: 68.38,35.62 73.12,40.75 68.38,37.12 73.12,42 66.75,37.12 71.5,42 66.75,35.62 71.5,40.75
  pour Top (isolate 1): 60,36.12 60,41.75 63.75,41.75 63.75,39.75 72.5,39.75 72.5,38.88 68.88,38.88 68.88,36.25
VCC_B  (via drill 0.4, 0.8)
  Top 0.305: U$9.A1 76.88,51.3 v76.88,51.25 | U$5.A1 76.88,31.3 v76.88,36.38 | U$4.A1 76.88,11.3 v76.88,11.38 | U$11.A1 3.7,8.7 v3.88,8.62 | U$14.A1 4.12,28.7 v3.88,28.62 | U$2.A1 4,48.7 v3.88,48.75 | U$8.A1 4,68.7 v3.88,68.75 | U$7.A1 28.4,68.75 v25.75,68.75 | U$10.A1 28.4,48.62 26.62,48.62 | v25.75,48.62 26.62,48.62 | U$15.A1 28.4,8.75 v25.75,8.75 | SJ7.1 26.51,48.64 26.62,48.62 | U$16.A1 54.75,11.3 v54.75,11.38 v54.75,3.75 | U$12.A1 54.75,31.3 v54.75,31.38 | U$6.A1 52.42,51.3 v52.88,51.75 | 71.6,71.25 U$3.A1 71.6,72.03 71,72.62 B2.1 | U$1.A1 52.67,71.3 55.62,74.25 v55.62,74.88 | v25.75,28.25 26.2,28.7 U$13.A1
  Top 0.813: 76.12,38.36 SJ9.2 75.75,36.38 v76.88,36.38 | v69.12,74.88 69.12,74 B2.1 | B.1 68.88,6 v68.88,3.75
  Bottom 0.305: 76.88,51.5 v76.88,51.25 | v54.75,11.38 v54.75,31.38 | v55.62,74.88 55.12,74.38 55.12,68.75 54.25,67.88 54.25,60.25 52.88,58.88 v52.88,51.75
  Bottom 0.813: v25.75,8.75 v25.75,28.25 v25.75,48.62 v25.75,68.75 25.75,76.12 3.88,76.12 v3.88,68.75 v3.88,48.75 v3.88,28.62 v3.88,8.62 3.88,3.75 v54.75,3.75 v68.88,3.75 76.88,3.75 v76.88,11.38 v76.88,36.38 76.88,51.5 76.88,74.88 v69.12,74.88 v55.62,74.88
VCC_G  (via drill 0.4, 0.8)
  Top 0.305: U$3.A2 78.62,70 78.62,70.25 | U$9.A2 78.62,50 78.62,49.88 | U$5.A2 78.62,30 78.62,29.88 | U$4.A2 78.62,10 78.62,9.88 | v2.5,10 U$11.A2 | v2.5,30 U$14.A2 | v2.5,50 U$2.A2 | v2.5,70 U$8.A2 | v27,70 U$7.A2 | U$10.A2 v27,50 25.25,50 25,50.25 SJ11.1 | v27,10 U$15.A2 | v27,30 U$13.A2 | U$16.A2 53.75,10 v53.75,2 55.88,2 v55.88,10.25 | U$12.A2 55.12,30 v55.88,29.25 | v54,70 U$1.A2 | U$6.A2 53.5,50 v53.5,48.38
  Top 0.813: G.1 v78.62,6 78.62,9.88 78.62,29.88 78.62,42.88 78.62,49.88 78.62,70.25 v78.62,74 G2.1
  Top 1.016: 78.62,42.88 SJ10.2
  Bottom 0.305: v55.88,10.25 v55.88,29.25 | v53.5,48.38 52.5,49.25 51.75,50 51.75,59.12 52.5,59.88 52.88,60.25 53.38,60.75 53.38,69.38 v54,70
  Bottom 0.813: v78.62,6 78.62,2 v53.75,2 2.5,2 v2.5,10 v2.5,30 v2.5,50 v2.5,70 2.5,77.75 27.12,77.75 27.12,70.5 27.12,70 | 27.12,70 v27,70 27.12,70 | 27.12,70 27.12,69.5 27.12,50.38 27.12,50 | 27.12,50 v27,50 27.12,50 | 27.12,50 27.12,49.38 27.12,30.38 27.12,30 | 27.12,30 v27,30 27.12,30 | 27.12,30 27.12,29.88 27.12,10.5 27.12,10 v27,10 | v54,70 54,77.62 78.62,77.62 v78.62,74
VCC_R  (via drill 0.4, 0.8)
  Top 0.305: U$9.A3 75.12,48.7 v75.12,48.62 | U$5.A3 75.12,28.7 v75.12,28.62 | U$11.A3 5.25,11.3 v5.25,11.25 | U$14.A3 5.25,31.3 v5.25,31.25 | U$2.A3 5.25,51.3 v5.25,51.25 | U$8.A3 5.25,71.3 v5.25,71.25 | U$7.A3 28.4,71.25 v24.38,71.25 | 28.4,51.12 U$10.A3 25.7,51.3 24.88,52.12 v24.38,52.12 | U$15.A3 28.4,11.25 v24.38,11.25 | U$13.A3 25.88,31.3 25.88,30.12 v24.38,30.12 | U$16.A3 51.62,8.68 v51.62,5.5 | U$12.A3 53.75,28.7 v53.75,28.62 | U$6.A3 51.58,47.33 v51.62,47.38 | U$3.A3 75.12,68.7 v75.12,68.5 | v56.12,72.75 56.12,70.25 54.58,68.7 U$1.A3 | U$4.A3 73.8,8.7 73.88,8.62 74,8.62
  Top 0.813: v75.12,48.62 75.12,46.76 SJ8.2 | v75.12,8.62 74,8.62 R.1 | v75.12,71.25 74,71.25 R2.1
  Bottom 0.305: 53.75,5.5 v53.75,28.62 | v51.62,47.38 52.25,46.75 53.88,46.75 54.38,47.25 54.75,47.62 54.75,48.75 53.88,49.62 53.88,58.38 54.88,59.5 55.12,59.75 55.12,67.12 56.12,68.12 v56.12,72.75
  Bottom 0.813: v24.38,11.25 v24.38,30.12 v24.38,52.12 v24.38,71.25 24.38,74.5 5.25,74.5 v5.25,71.25 v5.25,51.25 v5.25,31.25 v5.25,11.25 5.25,5.5 v51.62,5.5 53.75,5.5 75.12,5.5 v75.12,8.62 v75.12,28.62 v75.12,48.62 v75.12,68.5 v75.12,71.25 75.12,72.75 v56.12,72.75
XLAT  (via drill 0.4)
  Top 0.305: v38.38,47 38.38,41.25 41.62,38 41.62,31.5 42.67,30.45 IC3.P$30 | v38.38,47 38.38,46.12 | 38.38,46.12 38.38,48.75 37.2,49.92 IC2.P$30 | IC1.13 30.39,41.01 32,42.62 v32,43.5 | v38.38,47 38.38,46.12
  Bottom 0.305: v38.38,47 37.62,47 34.12,43.5 v32,43.5

### Text on the board
tStop: seb@exse.net | X16 LED Module v0.2a | - | + | . | G | B | 1 | R | 2 | G | 4 | 8 | 16 | 32 | B | <<</>> | + | - | TX | RX | Pentawall HD | B | R | G | RTS | CTS | SCL | SDA